# EAGLE design OLED-CAM-M8 (EAGLE 9.5.2)
CNAME: OLED-CAM-M8; CREVISION: 0.4; DESIGNER: gregcope@gmail.com
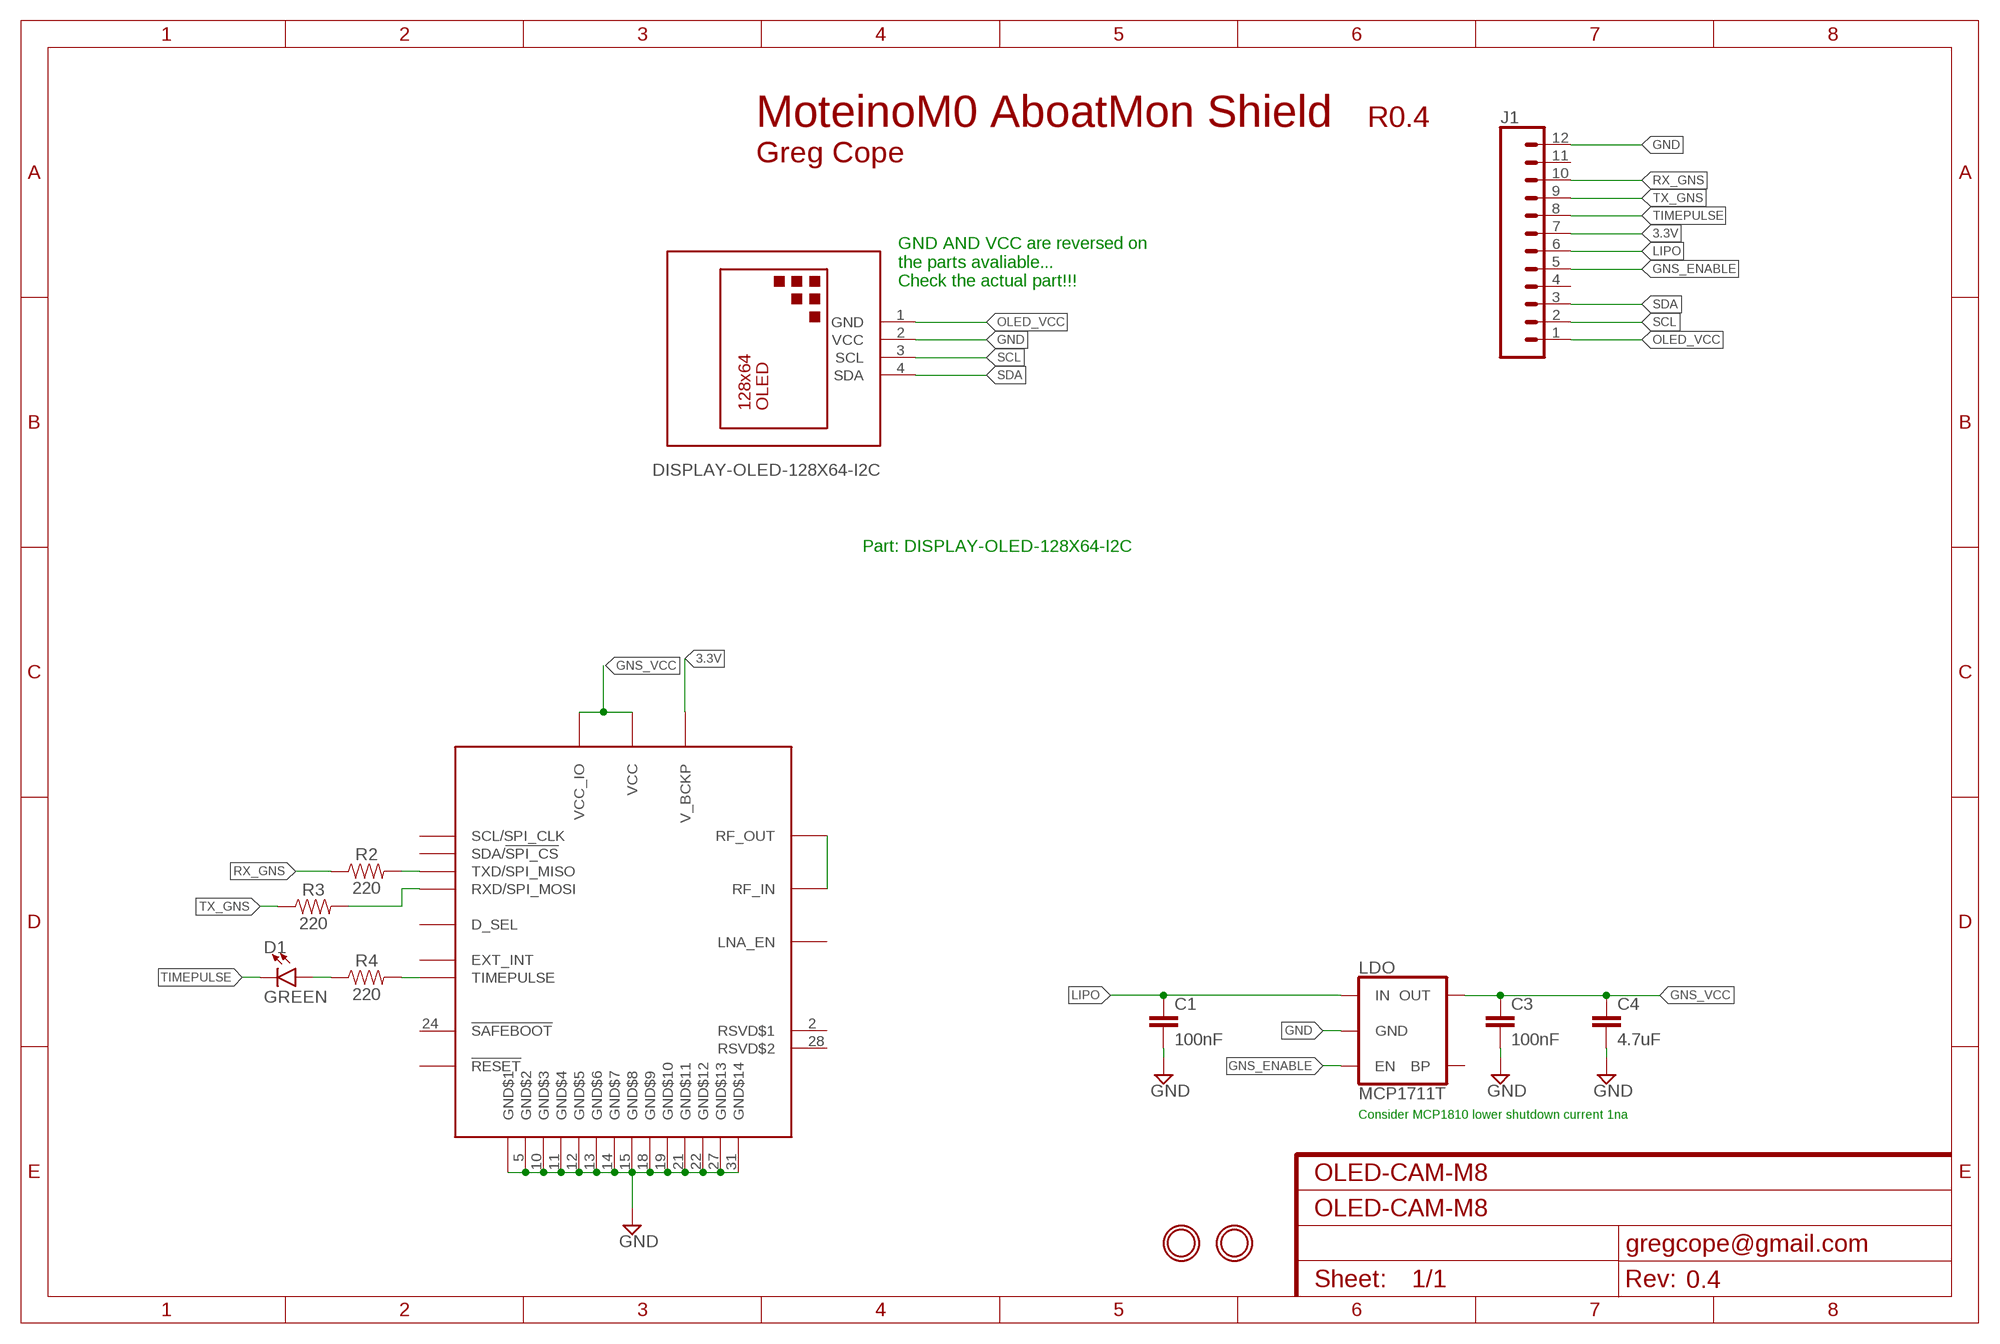
[diagram p0: schematic, sheet 1]

## Parts
C1  100nF  0.1UF-0603-25V-5%  [0603]
C3  100nF  0.1UF-0603-25V-5%  [0603]
C4  4.7uF  4.7UF0603  [0603]
D1  GREEN  LED-GREEN0603  [LED-0603]
GND  MOUNTINGHOLE2.5  [MOUNTINGHOLE_2.5_PLATED]
J1  CONN_12  [1X12]
LDO  MCP1711T  V_REG_SPX3819-SOT23-5  [SOT23-5]
R2  220  220OHM-0603-1/10W-1%  [0603]
R3  220  220OHM-0603-1/10W-1%  [0603]
R4  220  220OHM-0603-1/10W-1%  [0603]
U$2  DISPLAY-OLED-128X64-I2C  [DISPLAY-OLED-128X64-I2C]
U$5  CAM-M8  [CAM-M8]
U$7  MOUNTINGHOLE2.5  [MOUNTINGHOLE_2.5_PLATED]

## Nets
3.3V [gns]: J1.7 U$5.8(V_BCKP)
GND: C1.2 C3.2 C4.2 J1.12 LDO.2(GND) U$2.2(VCC) U$5.4(GND$1) U$5.5(GND$2) U$5.10(GND$3) U$5.11(GND$4) U$5.12(GND$5) U$5.13(GND$6) U$5.14(GND$7) U$5.15(GND$8) U$5.18(GND$9) U$5.19(GND$10) U$5.21(GND$11) U$5.22(GND$12) U$5.27(GND$13) U$5.31(GND$14)
GNS_ENABLE: J1.5 LDO.3(EN)
GNS_VCC [gns]: C3.1 C4.1 LDO.5(OUT) U$5.1(VCC_IO) U$5.9(VCC)
LIPO [power]: C1.1 J1.6 LDO.1(IN)
N$1 [gns]: R4.2 U$5.29(TIMEPULSE)
N$2 [gns]: R2.2 U$5.25(TXD/SPI_MISO)
N$3: R3.2 U$5.26(RXD/SPI_MOSI)
N$4: D1.A R4.1
N$5: U$5.16(RF_OUT) U$5.17(RF_IN)
OLED_VCC: J1.1 U$2.1(GND)
RX_GNS: J1.10 R2.1
SCL: J1.2 U$2.3(SCL)
SDA: J1.3 U$2.4(SDA)
TIMEPULSE: D1.C J1.8
TX_GNS: J1.9 R3.1
Unconnected: J1.4 J1.11 LDO.4(BP) U$5.2(RSVD$1) U$5.3(SDA/!SPI_CS) U$5.6(SCL/SPI_CLK) U$5.7(EXT_INT) U$5.20(D_SEL) U$5.23(!RESET) U$5.24(!SAFEBOOT) U$5.28(RSVD$2) U$5.30(LNA_EN)

## Notes on the sheet
- MoteinoM0 AboatMon Shield | R0.4
- Greg Cope
- GND AND VCC are reversed on
  the parts avaliable... 
  Check the actual part!!!
- Part: DISPLAY-OLED-128X64-I2C
- Consider MCP1810 lower shutdown current 1na

## Library data of the parts
C1 C3 = SparkFun-Capacitors:0.1UF: 0.1µF ceramic capacitors A capacitor is a passive two-terminal electrical component used to store electrical energy temporarily in an electric field.; PROD_ID: CAP-08604; VALUE: 0.1uF
C4 = SparkFun-Capacitors:4.7UF: 4.7µF ceramic capacitors A capacitor is a passive two-terminal electrical component used to store electrical energy temporarily in an electric field.; PROD_ID: CAP-08280
D1 = SparkFun-LED:LED-GREEN: Green SMD LED Used in manufacturing of various products at SparkFun Packages: 0603 - SMD 0603 package [Product Link] <http://www.futureelectronics.com/en/technologies/semiconductors/optoelectronics/leds/Pages/9894312-LTST-C190GKT.aspx?CrossPart=HSMG-C190&IM=0> LilyPad 1206 - SMD1206 LilyPad package [Product Link] <http://www.futureelectronics.com/en/Technologies/Product.aspx?ProductID=IN150NGHARVATEKCORPORATION2049943&IM=0> 1206 - SMD1206 package [Product Link] <http://www.futureelectronics.com/en/technologies/semiconductors/optoelectronics/leds/Pages/8315665-LTST-C150KGKT.aspx?IM=0> 1206 Bottom Mount -SMD 1206 Bottom Mount [Product Link] <http://www.digikey.com/product-detail/en/lite-on-inc/LTST-C230KGKT/160-1456-1-ND/386854> SparkFun Products: Pro Mini 328 -5V <https://www.sparkfun.com/products/821> RedBoard <https://www.sparkfun.com/products/12757> MP3 Trigger <https://www.sparkfun.com/products/13720> Makey Makey <https://www.sparkfun.com/products/11076>; PROD_ID: DIO-00821
GND U$7 = microbuilder:MOUNTINGHOLE: Mounting Hole For #2 screws (0.086"/2.18mm width, 0.094"/2.4mm hole) use 2.5mm
J1 = SparkFun-Connectors:CONN_12: Multi connection point. Often used as Generic Header-pin footprint for 0.1 inch spaced/style header connections On any of the 0.1 inch spaced packages, you can populate with these: Break Away Headers - Straight <https://www.sparkfun.com/products/116> (PRT-00116) Break Away Male Headers - Right Angle <https://www.sparkfun.com/products/553> (PRT-00553) Female Headers <https://www.sparkfun.com/products/115> (PRT-00115) Break Away Headers - Machine Pin <https://www.sparkfun.com/products/117> (PRT-00117) Break Away Female Headers - Swiss Machine Pin <https://www.sparkfun.com/products/743> (PRT-00743) For SCREWTERMINALS and SPRING TERMINALS visit here: Screw Terimnals on SparkFun.com <https://www.sparkfun.com/search/results?term=Screw+Terminals> (5mm/3.5mm/2.54mm spacing) This device is also useful as a general connection point to wire up your design to another part of your project. Our various solder wires solder well into these plated through hole pads. Hook-Up Wire - Assortment (Stranded, 22 AWG) <https://www.sparkfun.com/products/11375> (PRT-11375) Hook-Up Wire - Assortment (Solid Core, 22 AWG) <https://www.sparkfun.com/products/11367> (PRT-11367) View the entire wire category on our website here <https://www.sparkfun.com/categories/141> Special notes: Molex polarized connector foot print use with SKU : PRT-08231 with associated crimp pins and housings. 1MM SMD Version SKU: PRT-10208 NOTES ON THE VARIANTS LOCK and LOCK_LONGPADS... This footprint was designed to help hold the alignment of a through-hole component (i.e. 6-pin header) while soldering it into place. You may notice that each hole has been shifted either up or down by 0.005 of an inch from it's more standard position (which is a perfectly straight line). This slight alteration caused the pins (the squares in the middle) to touch the edges of the holes. Because they are alternating, it causes a "brace" to hold the component in place. 0.005 has proven to be the perfect amount of "off-center" position when using our standard breakaway headers. Although looks a little odd when you look at the bare footprint, once you have a header in there, the alteration is very hard to notice. Also,if you push a header all the way into place, it is covered up entirely on the bottom side.
LDO = SparkFun-IC-Power:V_REG_SPX3819: SPX3819 Voltage Regulator 3.3V 500mA, 16V input Datasheet <https://www.exar.com/content/document.ashx?id=22106> SparkFun Products: SparkFun Serial Controlled Motor Driver <https://www.sparkfun.com/products/13911>; PROD_ID: VREG-13321; VALUE: SPX3819M5_3_3
R2-R4 = SparkFun-Resistors:220OHM: 220Ω resistor A resistor is a passive two-terminal electrical component that implements electrical resistance as a circuit element. Resistors act to reduce current flow, and, at the same time, act to lower voltage levels within circuits. - Wikipedia; PROD_ID: RES-07861
U$2 = diy-modules:DISPLAY-OLED-128X64-I2C: 128x64 Dot Matrix OLED Module based on SSD1306 chip Variant with I2C interface More details available here: http://www.instructables.com/id/Monochrome-096-i2c-OLED-display-with-arduino-SSD13/ SSD1306 datasheet: https://cdn-shop.adafruit.com/datasheets/SSD1306.pdf Click here to find device on ebay.com <http://www.ebay.com/sch/oled+display+128x64+iic> Note: There are two variants: I2C and SPI. Search for the proper version.
U$5 = ubloxLib:CAM-M8: CAM-M8x: M8 Concurrent GNSS Antenna Module u-blox.com

## Net classes
0 default: width 0.61 mm, clearance 0.406 mm
1 power: width 0.61 mm, clearance 0.406 mm
2 gns: width 0.305 mm, clearance 0.305 mm

## Board
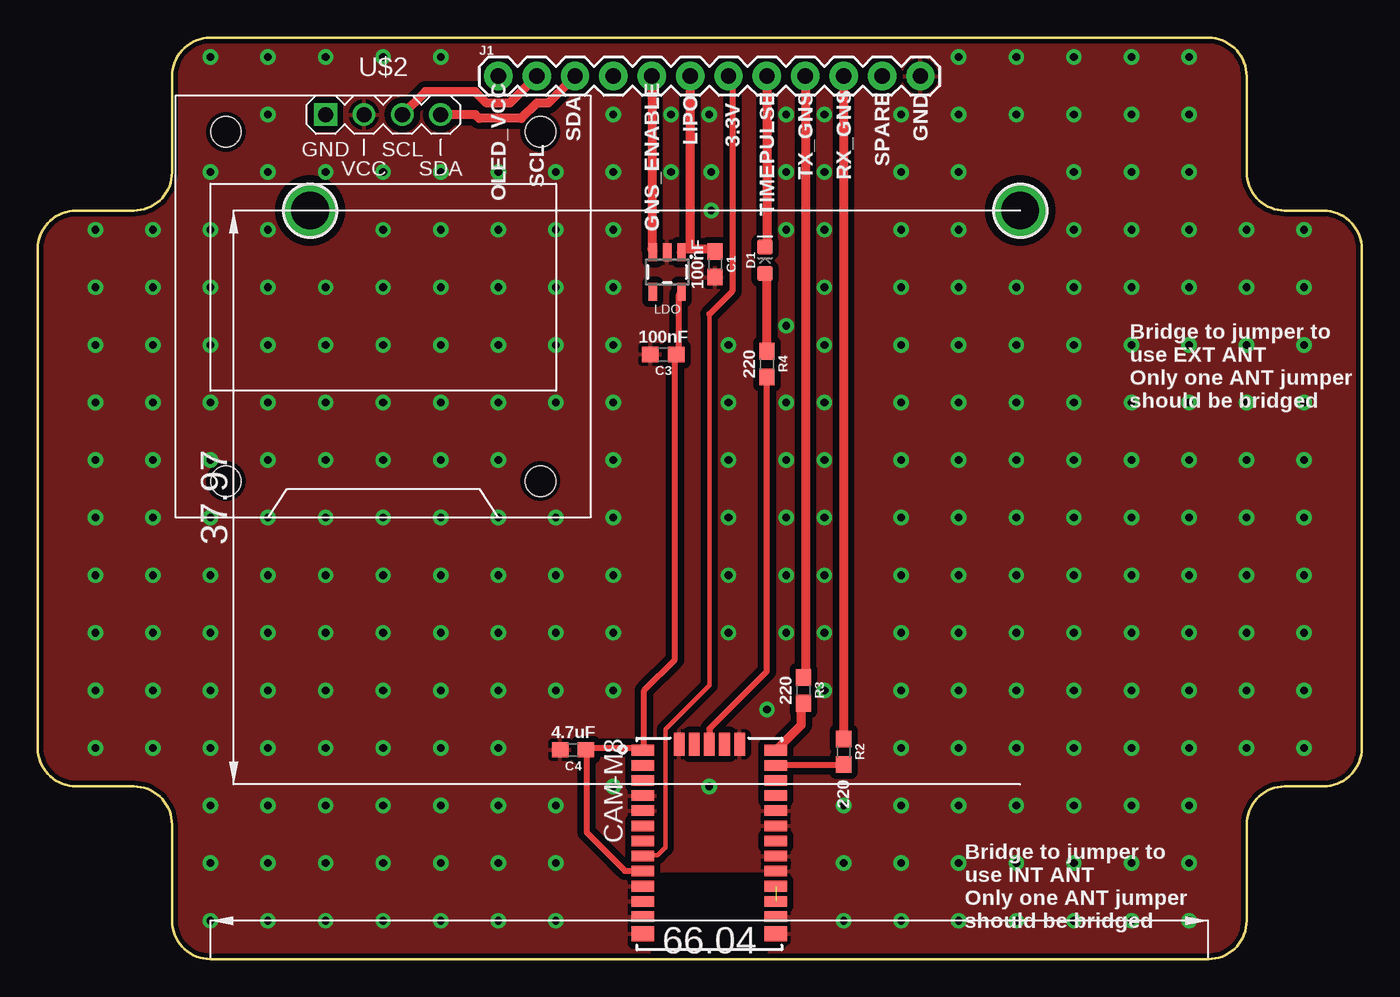
[diagram p1: board, top side]
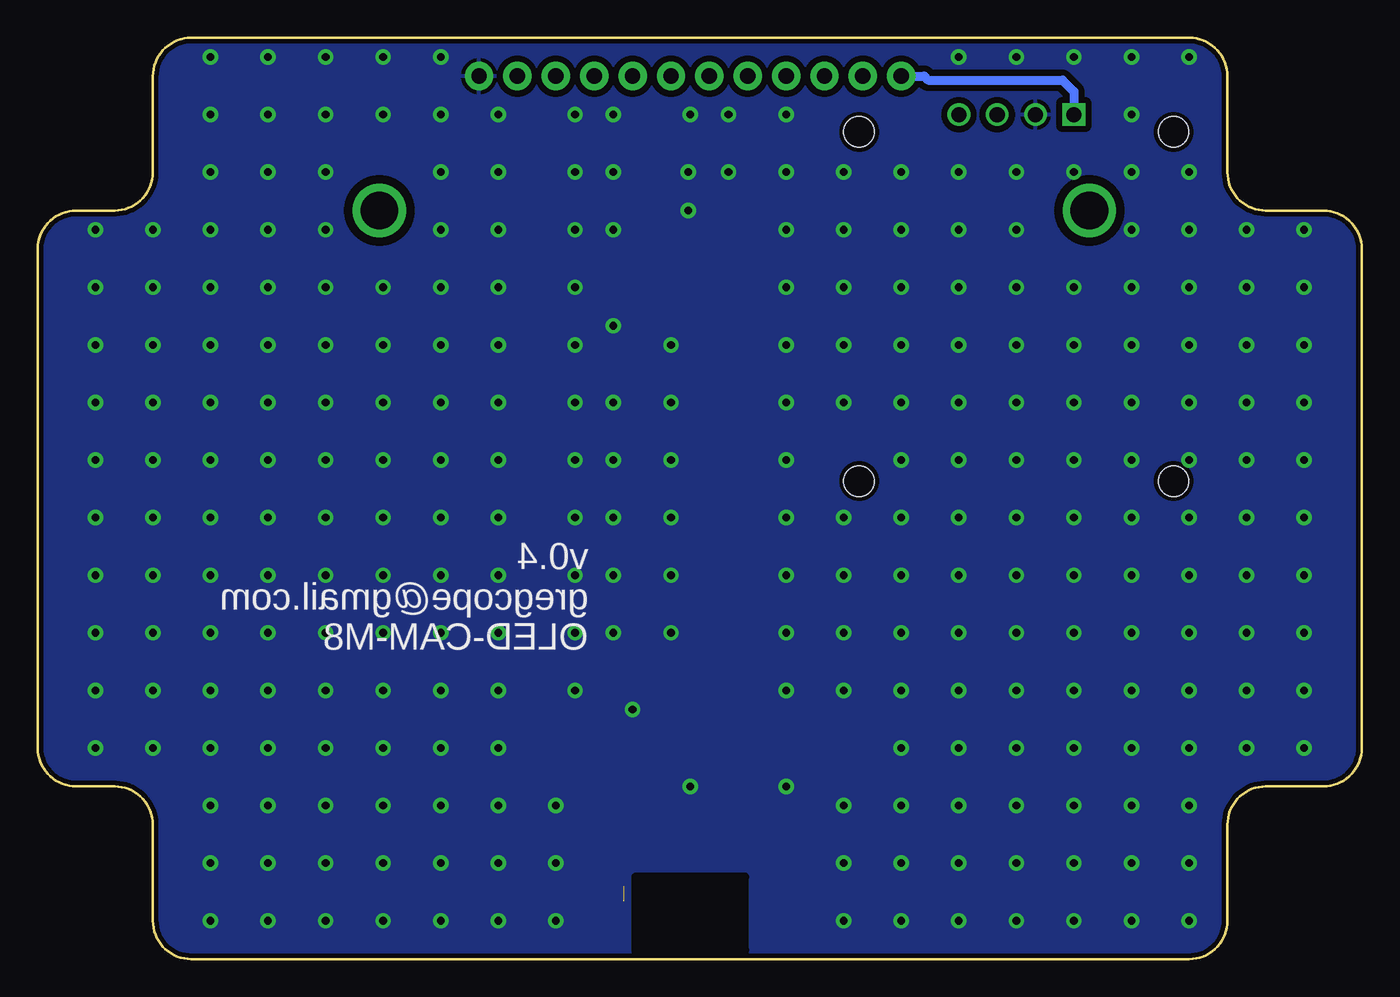
[diagram p2: board, bottom side, seen from below]

Size 87.63 x 60.96 mm. Coordinates in mm from the lower left corner, seen from the top.
Outline: 11.43,0 77.47,0 arc90 80.01,2.54 80.01,8.89 arc-90 82.55,11.43 85.09,11.43 arc90 87.63,13.97 87.63,46.99 arc90 85.09,49.53 82.55,49.53 arc-90 80.01,52.07 80.01,58.42 arc90 77.47,60.96 11.43,60.96 arc90 8.89,58.42 8.89,52.07 arc-90 6.35,49.53 2.54,49.53 arc90 0,46.99 0,13.97 arc90 2.54,11.43 6.35,11.43 arc-90 8.89,8.89 8.89,2.54 arc90 11.43,0
Copper layers (1*16): Top 0.035mm / dielectric 1.5mm / Bottom 0.035mm
Design rules "SparkFun-2-layer-STANDARD": minimum track width 10mil, minimum drill 20mil, track to track 10mil, track to pad 8mil, pad to pad 8mil, via to via 10mil, smd to smd 8mil, copper to edge 8mil, drill to drill 8mil, minimum pad ring 10mil, minimum via ring 10mil, stop-mask expansion 4mil, vias tented up to drill 25mil, thermal gap 10mil
tRestrict: 10 lines

### Footprints (pad centres in the part's own frame; a part is rotated, then mirrored left to right if it is on the bottom)
0603 = smd 1.1 x 1: 1 -0.85,0; 2 0.85,0
LED-0603 = smd 1 x 1: A -0.877,0; C 0.877,0
MOUNTINGHOLE_2.5_PLATED = drill 2.5 pad 3.2: P$1 0,0
1X12 = drill 1.016 pad 1.88: 1 0,0; 2 2.54,0; 3 5.08,0; 4 7.62,0; 5 10.16,0; 6 12.7,0; 7 15.24,0; 8 17.78,0; 9 20.32,0; 10 22.86,0; 11 25.4,0; 12 27.94,0
SOT23-5 = smd 0.55 x 1.2: 1 -0.95,-1.3; 2 0,-1.3; 3 0.95,-1.3; 4 0.95,1.3; 5 -0.95,1.3
DISPLAY-OLED-128X64-I2C = drill 1 square: 1 -3.81,12.7 | drill 1: 2 -1.27,12.7; 3 1.27,12.7; 4 3.81,12.7 | hole 2: -10.414,11.557; 10.414,11.557; 10.414,-11.557; -10.414,-11.557
CAM-M8 = smd 0.7 x 1.5: 1 -6.2,-4.4; 2 -5.2,-4.4; 3 -4.2,-4.4; 4 -3.2,-4.4; 5 -2.2,-4.4; 6 -1.2,-4.4; 7 -0.2,-4.4; 8 0.8,-4.4; 9 1.8,-4.4; 10 2.8,-4.4; 11 3.8,-4.4; 12 4.8,-4.4; 15 4.8,4.4; 16 3.8,4.4; 17 2.8,4.4; 18 1.8,4.4; 19 0.8,4.4; 20 -0.2,4.4; 21 -1.2,4.4; 22 -2.2,4.4; 23 -3.2,4.4; 24 -4.2,4.4; 25 -5.2,4.4; 26 -6.2,4.4 | smd 1 x 1.5: 13 5.95,-4.4; 14 5.95,4.4 | smd 1.5 x 0.7: 27 -6.6,2; 28 -6.6,1; 29 -6.6,0; 30 -6.6,-1; 31 -6.6,-2

### Placement (x,y rotation side)
C1  44.83,45.97 270 top
C3  41.4,40.01 180 top
C4  35.43,13.84 180 top
D1  48.13,46.23 90 top
GND  18.03,49.53 0 top
J1  30.48,58.42 0 top
LDO  41.66,45.47 180 top
R2  53.34,13.72 270 top
R3  50.67,17.78 270 top
R4  48.26,39.37 270 top
U$2  22.86,43.18 0 top
U$5  44.45,7.62 270 top
U$7  65.02,49.53 0 top

### Tracks (layer width: path | path; a pad name or v marks a point on that pad's centre or on a via)
3.3V
  Top 0.305: 44.45,42.67 44.45,18.11 41.54,15.2 41.54,7.37 41.53,7.37 41.02,6.86 40.13,6.86 U$5.8
  Top 0.406: 44.45,42.67 45.97,44.2 45.97,58.17 J1.7
GND  (via drill 0.51)
  other vias: 38.1,11.43 45.72,21.59 44.45,55.88 52.07,52.07 41.91,55.88 11.43,2.54 11.43,6.35 15.24,6.35 15.24,2.54 19.05,2.54 19.05,6.35 22.86,6.35 22.86,2.54 26.67,2.54 26.67,6.35 30.48,6.35 30.48,2.54 34.29,6.35 34.29,2.54 38.1,29.21 38.1,25.4 45.72,29.21 45.72,33.02 45.72,36.83 49.53,36.83 49.53,33.02 49.53,29.21 45.72,25.4 57.15,36.83 57.15,33.02 60.96,36.83 60.96,33.02 11.43,17.78 11.43,21.59 15.24,21.59 15.24,17.78 19.05,17.78 19.05,21.59 22.86,21.59 22.86,17.78 26.67,17.78 26.67,21.59 30.48,21.59 30.48,17.78 38.1,21.59 3.81,40.64 3.81,44.45 7.62,44.45 7.62,40.64 11.43,40.64 11.43,44.45 15.24,44.45 15.24,40.64 19.05,40.64 19.05,44.45 22.86,44.45 22.86,40.64 26.67,44.45 26.67,40.64 3.81,25.4 3.81,29.21 7.62,29.21 7.62,25.4 11.43,25.4 11.43,29.21 15.24,29.21 15.24,25.4 19.05,25.4 19.05,29.21 22.86,29.21 22.86,25.4 26.67,29.21 26.67,25.4 3.81,33.02 3.81,36.83 7.62,36.83 7.62,33.02 11.43,33.02 11.43,36.83 15.24,36.83 15.24,33.02 19.05,33.02 19.05,36.83 22.86,36.83 22.86,33.02 26.67,36.83 26.67,33.02 57.15,25.4 57.15,29.21 60.96,29.21 60.96,25.4 64.77,25.4 64.77,29.21 68.58,29.21 68.58,25.4 72.39,25.4 72.39,29.21 76.2,25.4 80.01,29.21 80.01,25.4 57.15,17.78 57.15,21.59 60.96,21.59 60.96,17.78 64.77,17.78 64.77,21.59 68.58,21.59 68.58,17.78 72.39,17.78 72.39,21.59 76.2,21.59 76.2,17.78 80.01,21.59 80.01,17.78 57.15,10.16 57.15,13.97 60.96,13.97 60.96,10.16 68.58,13.97 68.58,10.16 72.39,10.16 72.39,13.97 76.2,13.97 76.2,10.16 80.01,13.97 83.82,17.78 64.77,33.02 64.77,36.83 68.58,36.83 68.58,33.02 72.39,33.02 72.39,36.83 76.2,36.83 80.01,33.02 80.01,36.83 83.82,36.83 83.82,25.4 83.82,44.45 83.82,21.59 83.82,13.97 53.34,10.16 53.34,6.35 53.34,2.54 57.15,2.54 57.15,6.35 60.96,6.35 60.96,2.54 64.77,2.54 64.77,6.35 68.58,6.35 68.58,2.54 72.39,6.35 72.39,2.54 11.43,10.16 11.43,13.97 15.24,13.97 15.24,10.16 19.05,13.97 22.86,13.97 22.86,10.16 26.67,10.16 26.67,13.97 30.48,13.97 30.48,10.16 44.45,11.43 7.62,48.26 3.81,48.26 30.48,44.45 30.48,40.64 34.29,40.64 30.48,36.83 30.48,33.02 34.29,36.83 30.48,29.21 34.29,44.45 11.43,48.26 11.43,52.07 15.24,52.07 15.24,48.26 44.58,49.53 19.05,52.07 22.86,52.07 22.86,48.26 26.67,48.26 26.67,52.07 30.48,52.07 30.48,48.26 34.29,52.07 34.29,48.26 57.15,55.88 15.24,55.88 60.96,59.69 60.96,55.88 64.77,55.88 64.77,59.69 68.58,59.69 68.58,55.88 72.39,55.88 72.39,59.69 76.2,59.69 76.2,55.88 15.24,59.69 11.43,59.69 57.15,48.26 57.15,52.07 60.96,52.07 60.96,48.26 83.82,40.64 83.82,48.26 68.58,52.07 68.58,48.26 72.39,48.26 72.39,52.07 76.2,52.07 76.2,48.26 80.01,48.26 52.07,55.88 52.07,48.26 52.07,44.45 52.07,40.64 49.53,25.4 49.53,21.59 52.07,36.83 52.07,33.02 52.07,29.21 52.07,25.4 52.07,21.59 52.07,17.78 48.26,16.51 3.81,21.59 3.81,17.78 3.81,13.97 7.62,13.97 7.62,17.78 7.62,21.59 49.53,41.91 49.53,48.26 49.53,52.07 49.53,55.88 44.58,52.07 41.91,52.07 57.15,40.64 57.15,44.45 60.96,44.45 60.96,40.64 64.77,40.64 64.77,44.45 68.58,44.45 68.58,40.64 72.39,40.64 72.39,44.45 76.2,44.45 76.2,40.64 80.01,44.45 80.01,40.64 19.05,59.69 22.86,59.69 26.67,59.69 19.05,10.16 64.77,10.16 64.77,13.97 38.1,17.78 45.72,40.64 34.29,17.78 34.29,10.16 34.29,21.59 34.29,25.4 30.48,25.4 34.29,29.21 38.1,33.02 38.1,36.83 38.1,40.64 38.1,44.45 38.1,48.26 38.1,52.07 38.1,55.88 76.2,6.35 76.2,2.54 76.2,29.21 76.2,33.02 83.82,33.02 83.82,29.21
  pour Top (isolate 0.305): 11.43,60.96 77.47,60.96 arc-90 80.01,58.42 80.01,52.07 arc90 82.55,49.53 85.09,49.53 arc-90 87.63,46.99 87.63,13.97 arc-90 85.09,11.43 82.55,11.43 arc90 80.01,8.89 80.01,2.54 arc-90 77.47,0 11.43,0 arc-90 8.89,2.54 8.89,8.89 arc90 6.35,11.43 2.54,11.43 arc-90 0,13.97 0,46.99 arc-90 2.54,49.53 6.35,49.53 arc90 8.89,52.07 8.89,58.42 arc-90
  pour Bottom (isolate 0.305): 11.43,60.96 77.47,60.96 arc-90 80.01,58.42 80.01,52.07 arc90 82.55,49.53 85.09,49.53 arc-90 87.63,46.99 87.63,13.97 arc-90 85.09,11.43 82.55,11.43 arc90 80.01,8.89 80.01,2.54 arc-90 77.47,0 11.43,0 arc-90 8.89,2.54 8.89,8.89 arc90 6.35,11.43 2.54,11.43 arc-90 0,13.97 0,46.99 arc-90 2.54,49.53 6.35,49.53 arc90 8.89,52.07 8.89,58.42 arc-90
GNS_ENABLE
  Top 0.61: J1.5 40.64,46.99 LDO.3
GNS_VCC
  Top 0.305: 42.42,40.13 C3.1 42.16,39.88 | 36.32,13.72 C4.1
  Top 0.406: C4.1 36.32,13.97 39.88,13.97 U$5.1 40.13,13.97 40.13,17.78 42.16,19.81 42.16,39.88 | 42.42,40.13 42.42,43.94 LDO.5 | 36.32,13.72 36.32,8.38 38.86,5.84 39.88,5.84 U$5.9
LIPO
  Top 0.61: 43.18,46.99 42.67,46.99 LDO.1 | 43.18,46.99 44.7,46.99 C1.1 | J1.6 43.18,46.99
N$1
  Top 0.406: R4.2 48.26,19.05 44.45,15.24 U$5.29
N$2
  Top 0.406: R2.2 53.29,12.82 U$5.25
N$3
  Top 0.61: R3.2 50.55,16.76 50.55,15.49 49.02,13.97 U$5.26
N$4
  Top 0.61: R4.1 48.26,45.21 D1.A
N$5  (1 unrouted)
OLED_VCC
  Bottom 0.61: U$2.1 19.05,57.4 19.81,58.17 28.7,58.17 28.96,58.42 J1.1
RX_GNS
  Top 0.61: J1.10 R2.1
SCL
  Top 0.61: U$2.3 25.65,57.4 28.96,57.4 29.72,56.64 31.24,56.64 J1.2
SDA
  Top 0.61: U$2.4 28.96,55.88 29.21,55.63 32,55.63 33.02,56.64 33.78,56.64 J1.3
TIMEPULSE
  Top 0.61: J1.8 48.26,47.24 D1.C
TX_GNS
  Top 0.61: J1.9 50.8,18.8 R3.1

### Text on the board
tNames: SDA | LIPO | 3.3V | GND | TX_GNS | RX_GNS | SPARE | SCL | OLED_VCC | TIMEPULSE | GNS_ENABLE | Bridge to jumper to / use EXT ANT / Only one ANT jumper / should be bridged | Bridge to jumper to / use INT ANT / Only one ANT jumper / should be bridged
bNames: v0.4 / gregcope@gmail.com / OLED-CAM-M8